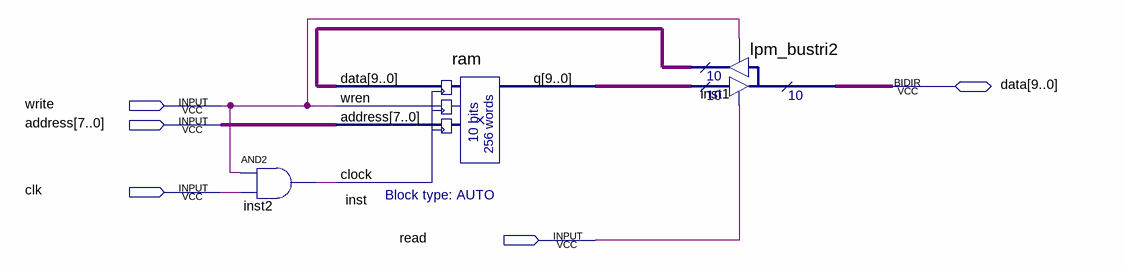
[diagram p0: schematic sheet]
// Quartus schematic ram0.bdf as structural Verilog: 3 symbols, 5 pins
module ram0 (
  input  write,
  input  [7:0] address,
  input  clk,
  input  read,
  inout  [9:0] data
);

  wire inst2_out;
  wire [9:0] inst1_result, inst_q;

  and inst2 (inst2_out, write, clk);
  ram inst (.data(inst1_result), .wren(write), .address(address), .clock(inst2_out), .q(inst_q));
  lpm_bustri2 inst1 (.enabledt(read), .data(inst_q), .enabletr(write), .result(inst1_result), .tridata(data));
endmodule
